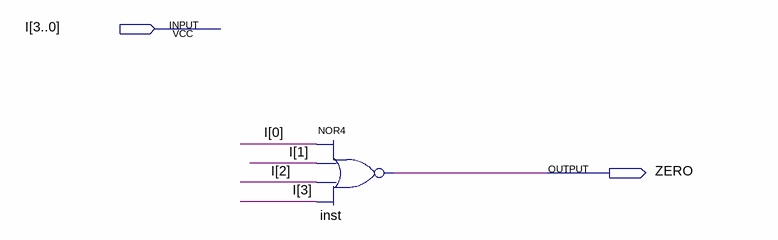
[diagram p0: schematic sheet]
// Quartus schematic ZERO.bdf as structural Verilog: 1 symbols, 2 pins
module ZERO (
  input  [3:0] I,
  output ZERO
);

  nor inst (ZERO, I[0], I[1], I[2], I[3]);
endmodule
